# Altium schematic sheet Power.SchDoc
size A3; SheetNumber: 4; SheetTotal: 4
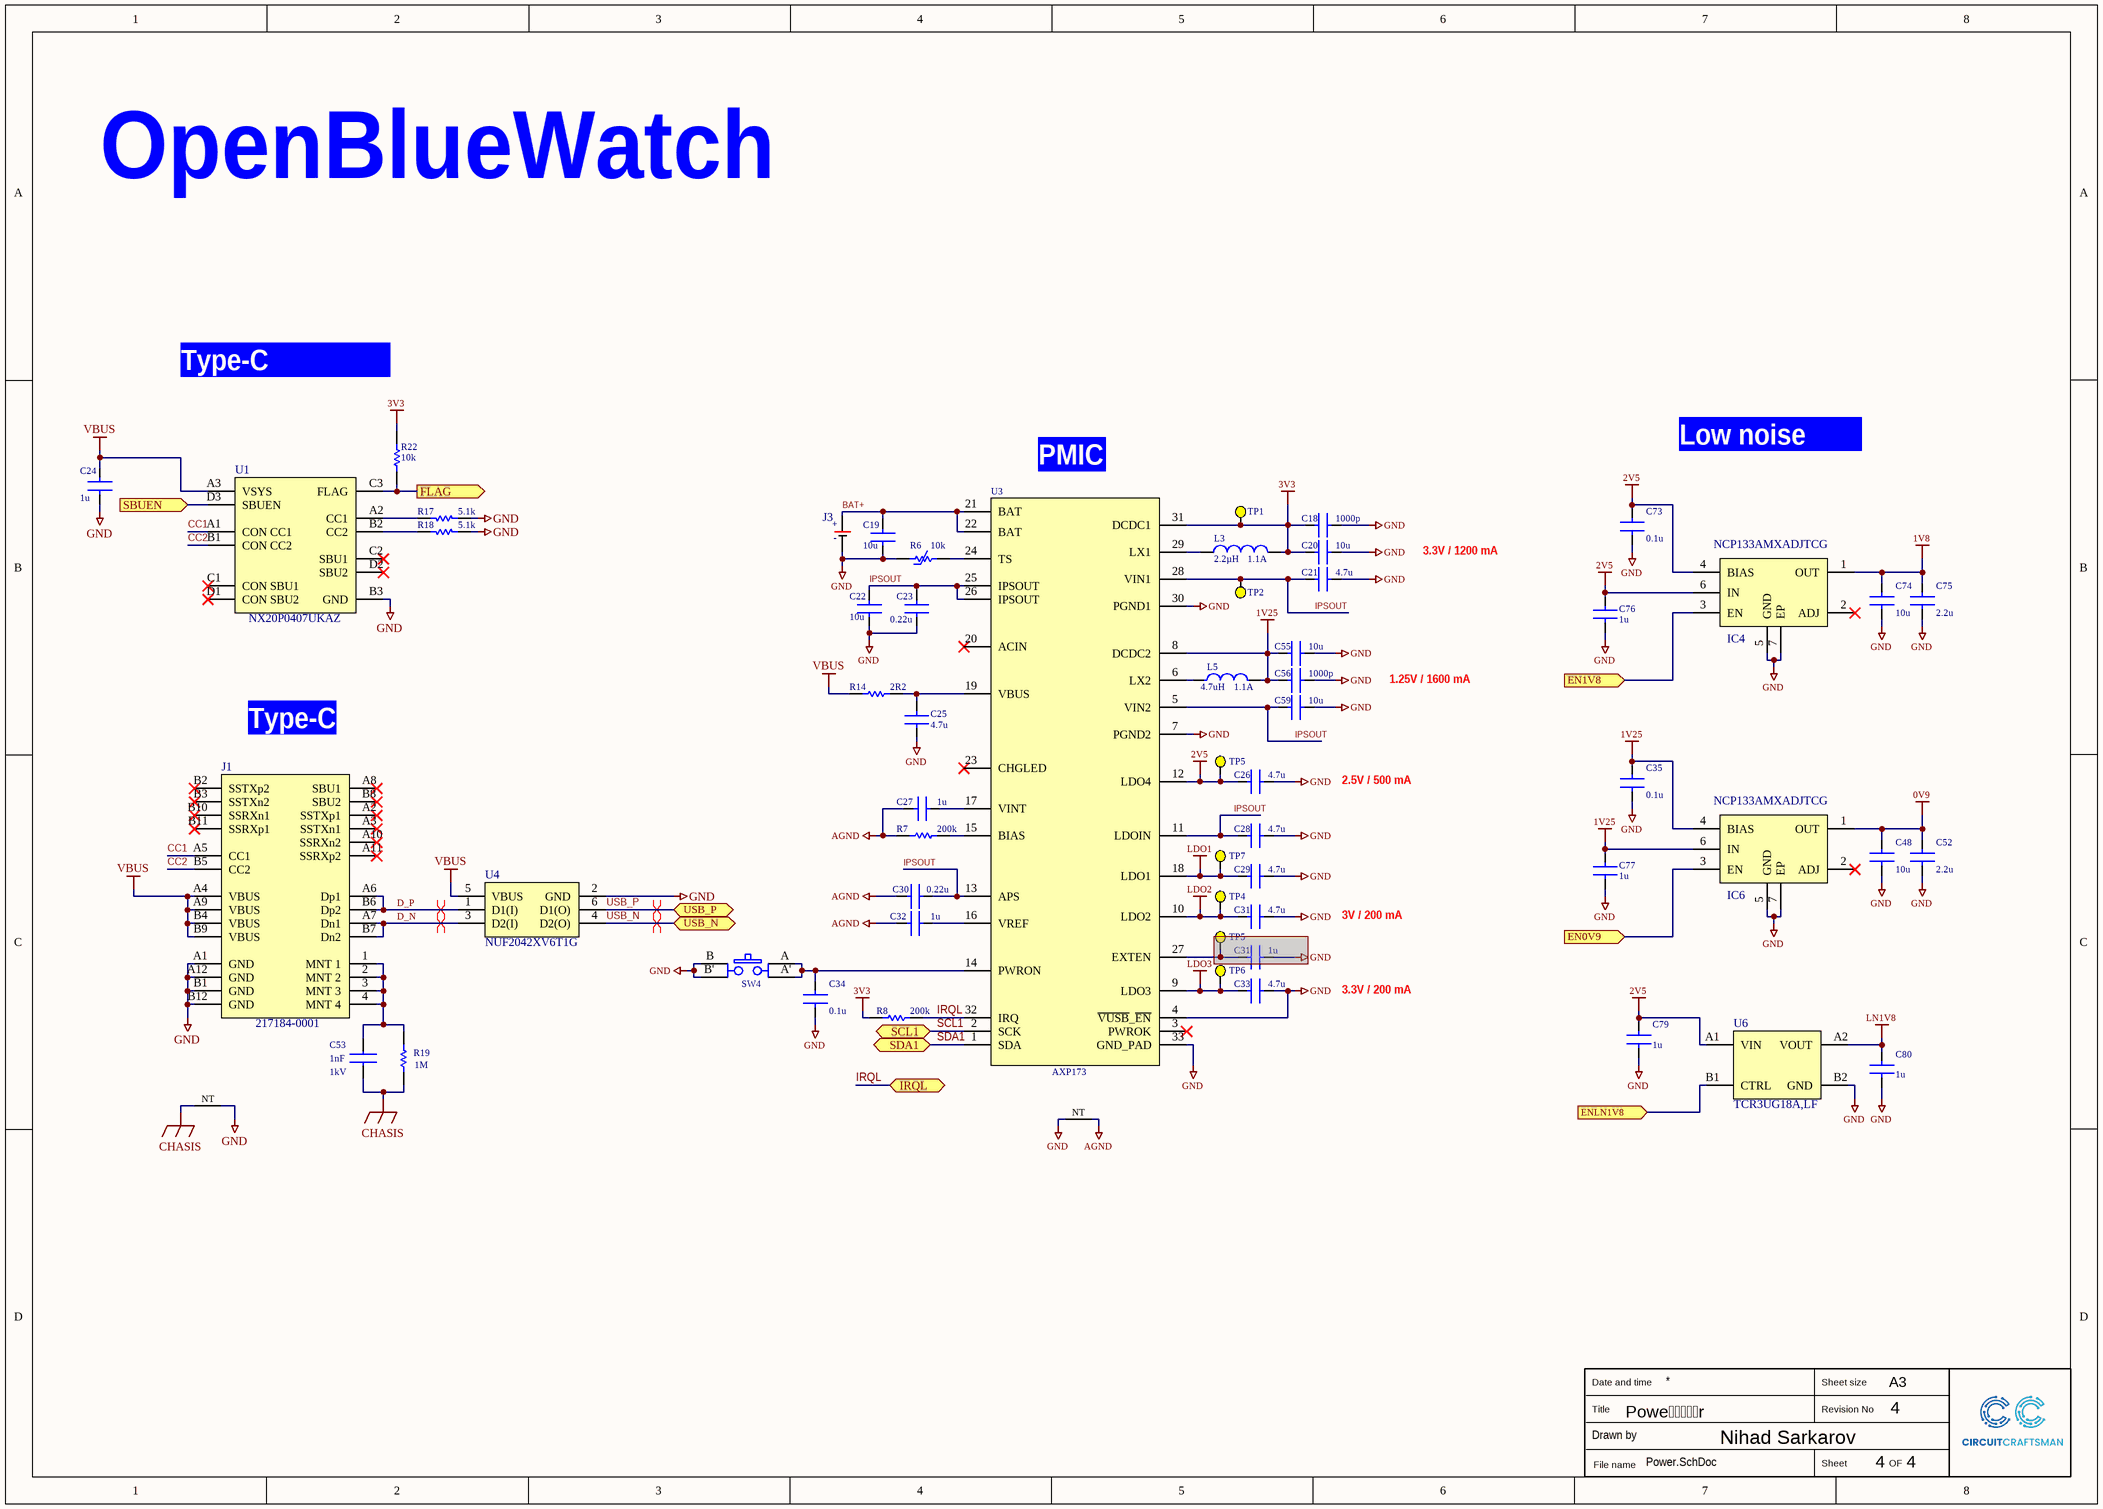
[diagram p0: Power.SchDoc]

## Parts
(Parts that share a designator on the sheet are numbered #1, #2 ... from top to bottom, then left to right.)
C18  Capacitance: 1000p  [FP-C1608-080-0_1-MFG]  (hidden comment: C1608X7R1E105K080AB)
C19  Capacitance: 10u  [FP-C1608-080-0_1-MFG]  (hidden comment: C1608X7R1E105K080AB)
C20  Capacitance: 10u  [FP-C1608-080-0_1-MFG]  (hidden comment: C1608X7R1E105K080AB)
C21  Capacitance: 4.7u  [FP-C1608-080-0_1-MFG]  (hidden comment: C1608X7R1E105K080AB)
C22  Capacitance: 10u  [FP-C1608-080-0_1-MFG]  (hidden comment: C1608X7R1E105K080AB)
C23  Capacitance: 0.22u  [FP-C1608-080-0_1-MFG]  (hidden comment: C1608X7R1E105K080AB)
C24  Capacitance: 1u  [FP-C1608-080-0_1-MFG]  (hidden comment: C1608X7R1E105K080AB)
C25  Capacitance: 4.7u  [FP-C1608-080-0_1-MFG]  (hidden comment: C1608X7R1E105K080AB)
C26  Capacitance: 4.7u  [FP-C1608-080-0_1-MFG]  (hidden comment: C1608X7R1E105K080AB)
C27  Capacitance: 1u  [FP-C1608-080-0_1-MFG]  (hidden comment: C1608X7R1E105K080AB)
C28  Capacitance: 4.7u  [FP-C1608-080-0_1-MFG]  (hidden comment: C1608X7R1E105K080AB)
C29  Capacitance: 4.7u  [FP-C1608-080-0_1-MFG]  (hidden comment: C1608X7R1E105K080AB)
C30  Capacitance: 0.22u  [FP-C1608-080-0_1-MFG]  (hidden comment: C1608X7R1E105K080AB)
C31#1  Capacitance: 4.7u  [FP-C1608-080-0_1-MFG]  (hidden comment: C1608X7R1E105K080AB)
C31#2  value 1u  [FP-CC0201-BA-MFG]  (hidden comment: CC0201KRX7R8BB102)  (masked out: inside a compile mask, not in the netlist)
C32  Capacitance: 1u  [FP-C1608-080-0_1-MFG]  (hidden comment: C1608X7R1E105K080AB)
C33  Capacitance: 4.7u  [FP-C1608-080-0_1-MFG]  (hidden comment: C1608X7R1E105K080AB)
C34  value 0.1u  [FP-CC0402-IPC_C]  (hidden comment: CC0402KRX7R7BB104)
C35  value 0.1u  [FP-CC0402-IPC_C]  (hidden comment: CC0402KRX7R7BB104)
C48  Capacitance: 10u  [FP-C1608-080-0_1-MFG]  (hidden comment: C1608X7R1E105K080AB)
C52  Capacitance: 2.2u  [FP-C1608-080-0_1-MFG]  (hidden comment: C1608X7R1E105K080AB)
C53  Capacitance: 1nF  Voltage - Rated: 1kV  [CAPC1608X90N]  (hidden comment: C0603V102KDRAC7867)
C55  Capacitance: 10u  [FP-C1608-080-0_1-MFG]  (hidden comment: C1608X7R1E105K080AB)
C56  Capacitance: 1000p  [FP-C1608-080-0_1-MFG]  (hidden comment: C1608X7R1E105K080AB)
C59  Capacitance: 10u  [FP-C1608-080-0_1-MFG]  (hidden comment: C1608X7R1E105K080AB)
C73  value 0.1u  [FP-CC0402-IPC_C]  (hidden comment: CC0402KRX7R7BB104)
C74  Capacitance: 10u  [FP-C1608-080-0_1-MFG]  (hidden comment: C1608X7R1E105K080AB)
C75  Capacitance: 2.2u  [FP-C1608-080-0_1-MFG]  (hidden comment: C1608X7R1E105K080AB)
C76  Capacitance: 1u  [FP-C1608-080-0_1-MFG]  (hidden comment: C1608X7R1E105K080AB)
C77  Capacitance: 1u  [FP-C1608-080-0_1-MFG]  (hidden comment: C1608X7R1E105K080AB)
C79  value 1u  [FP-CC0402-IPC_C]  (hidden comment: CC0402KRX7R7BB104)
C80  value 1u  [FP-CC0402-IPC_C]  (hidden comment: CC0402KRX7R7BB104)
IC4  NCP133AMXADJTCG  [NCP133AMX110TCG]
IC6  NCP133AMXADJTCG  [NCP133AMX110TCG]
J1  217184-0001  [FP-217184-0001-MFG]
J3  Battery connector  [JST-PH 2.0MM]  (value not drawn)
L3  Inductance: 2.2µH  Current - Saturation: 1.1A  [INDC2013X140X50LL20T20]  (hidden comment: BRC2012T2R2MD)
L5  Max DC Current: 1.1A  Inductance: 4.7uH  [FP-LQM2MPN_G0-MFG]  (hidden comment: LQM2MPN4R7MG0L)
Nt1  Net tie  [Net tie]  (value not drawn)  (net tie, no BOM)
Nt2  Net tie  [Net tie]  (value not drawn)  (net tie, no BOM)
R6  Resistance: 10k  [FP-NTSD1_FPB30-MFG]  (hidden comment: NTSD1XH103FPB30)
R7  Resistance: 200k  [RESC1005X40X25LL05T05]  (hidden comment: CRCW040222R0FKED)
R8  Resistance: 200k  [RESC0603X28X15LL5T05]  (hidden comment: CRCW02010000Z0ED)
R14  Resistance: 2R2  [RESC1005X40X25LL05T05]  (hidden comment: CRCW040222R0FKED)
R17  Resistance: 5.1k  [RESC0603X28X15LL5T05]  (hidden comment: CRCW02010000Z0ED)
R18  Resistance: 5.1k  [RESC0603X28X15LL5T05]  (hidden comment: CRCW02010000Z0ED)
R19  Resistance: 1M  [RESC1005X40X25ML05T05]  (hidden comment: ERJ-2GEJ105X)
R22  Resistance: 10k  [RESC0603X28X15LL5T05]  (hidden comment: CRCW02010000Z0ED)
SW4  EVP-BB2A9B000  [FP-EVP-BB2A9B000-MFG]  (value not drawn)
TP1  Test point  [Test point]  (value not drawn)
TP2  Test point  [Test point]  (value not drawn)
TP4  Test point  [Test point]  (value not drawn)
TP5#1  Test point  [Test point]  (value not drawn)
TP5#2  Test point  [Test point]  (value not drawn)  (masked out: inside a compile mask, not in the netlist)
TP6  Test point  [Test point]  (value not drawn)
TP7  Test point  [Test point]  (value not drawn)
U1  NX20P0407UKAZ  [FP-SOT1390-7-IPC_A]
U3  AXP173  [QFN40P400X400X55-33N]
U4  NUF2042XV6T1G  [FP-463A-MFG]
U6  TCR3UG18A,LF  [FP-WCSP4F-IPC_C]

## Ports
EN0V9 (in, see MCU[2C]), EN1V8 (in, see MCU[4A]), ENLN1V8 (in, see MCU[4B]), FLAG (out, see MCU[2B]), IRQL (bidir, see MCU[5D]), SBUEN (in, see MCU[2B]), SCL1 (bidir, see MCU[4D]), SDA1 (bidir, see MCU[4D]), USB_N (bidir, see MCU[6A]), USB_P (bidir, see MCU[6A])

## Nets
0V9: C48.1 C52.1 IC6.1(OUT)
1V8: C74.1 C75.1 IC4.1(OUT)
1V25: C35.1 C55.1 C56.1 C77.1 IC6.4(BIAS) IC6.6(IN) L5.2 U3.8(DCDC2)
2V5: C26.1 C73.1 C76.1 C79.1 IC4.4(BIAS) IC4.6(IN) TP5#1.1 U3.12(LDO4) U6.A1(VIN)
3V3: C18.1 C20.1 L3.2 R8.2 R22.1 TP1.1 U3.31(DCDC1)
AGND: C27.2 C30.2 C32.2 Nt1.2 R7.1
CHASIS: C53.1 Nt2.1 R19.1
GND: C18.2 C19.1 C20.2 C21.2 C22.1 C23.1 C24.2 C25.1 C26.2 C28.2 C29.2 C31#1.2 C33.2 C34.2 C35.2 C48.2 C52.2 C55.2 C56.2 C59.2 C73.2 C74.2 C75.2 C76.2 C77.2 C79.2 C80.2 IC4.5(GND) IC4.7(EP) IC6.5(GND) IC6.7(EP) J1.A1(GND) J1.A12(GND) J1.B1(GND) J1.B12(GND) J3.2(GND) Nt1.1 Nt2.2 R6.1 R17.1 R18.1 SW4.B SW4.B' U1.B3(GND) U3.4(~{VUSB}_~{EN}) U3.7(PGND2) U3.30(PGND1) U3.33(GND_PAD) U4.2(GND) U6.B2(GND)
LDO1: C29.1 TP7.1 U3.18(LDO1)
LDO2: C31#1.1 TP4.1 U3.10(LDO2)
LDO3: C33.1 TP6.1 U3.9(LDO3)
LN1V8: C80.1 U6.A2(VOUT)
VBUS: C24.1 J1.A4(VBUS) J1.A9(VBUS) J1.B4(VBUS) J1.B9(VBUS) R14.1 U1.A3(VSYS) U4.5(VBUS)
BAT+: C19.2 J3.1(+) U3.21(BAT) U3.22(BAT)
CC1: J1.A5(CC1) U1.A1(CON_CC1)
CC2: J1.B5(CC2) U1.B1(CON_CC2)
D_N: J1.A7(Dn1) J1.B7(Dn2) U4.3(D2(I))
D_P: J1.A6(Dp1) J1.B6(Dp2) U4.1(D1(I))
EN0V9: IC6.3(EN) ; port EN0V9
EN1V8: IC4.3(EN) ; port EN1V8
ENLN1V8: U6.B1(CTRL) ; port ENLN1V8
FLAG: R22.2 U1.C3(FLAG) ; port FLAG
IPSOUT: C21.1 C22.2 C23.2 C28.1 C30.1 C59.1 TP2.1 U3.5(VIN2) U3.11(LDOIN) U3.13(APS) U3.25(IPSOUT) U3.26(IPSOUT) U3.28(VIN1)
IRQL: R8.1 U3.32(IRQ) ; port IRQL
SBUEN: U1.D3(SBUEN) ; port SBUEN
SCL1: U3.2(SCK) ; port SCL1
SDA1: U3.1(SDA) ; port SDA1
USB_N: U4.4(D2(O)) ; port USB_N
USB_P: U4.6(D1(O)) ; port USB_P
NetC25_2: C25.2 R14.2 U3.19(VBUS)
NetC27_1: C27.1 U3.17(VINT)
NetC32_1: C32.1 U3.16(VREF)
NetC34_1: C34.1 SW4.A SW4.A' U3.14(PWRON)
NetC53_2: C53.2 J1.1(MNT_1) J1.2(MNT_2) J1.3(MNT_3) J1.4(MNT_4) R19.2
NetL3_1: L3.1 U3.29(LX1)
NetL5_1: L5.1 U3.6(LX2)
NetR6_2: R6.2 U3.24(TS)
NetR7_2: R7.2 U3.15(BIAS)
NetR17_2: R17.2 U1.A2(CC1)
NetR18_2: R18.2 U1.B2(CC2)

Not connected (* = marked no-connect by the designer): IC4 2(ADJ)*; IC6 2(ADJ)*; J1 A2(SSTXp1)* A3(SSTXn1)* A8(SBU1)* A10(SSRXn2)* A11(SSRXp2)* B2(SSTXp2)* B3(SSTXn2)* B8(SBU2)* B10(SSRXn1)* B11(SSRXp1)*; U1 C1(CON_SBU1)* C2(SBU1)* D1(CON_SBU2)* D2(SBU2)*; U3 3(PWROK)* 20(ACIN)* 23(CHGLED)* 27(EXTEN)

## Layout directives
differential pair; differential pair class 90USB: D_N, D_P, USB_N, USB_P

## Notes on the sheet
- OpenBlueWatch
- Type-C protection
- Low noise LDOs
- (near U3) PMIC
- 3.3V / 1200 mA
- 1.25V / 1600 mA
- Type-C
- 2.5V / 500 mA
- 3V / 200 mA
- 3.3V / 200 mA
- Power
- 4
- Date and time
- Sheet size
- A3
- Title
- Drawn by
- File name
- Nihad Sarkarov
- Sheet
- Revision No
- OF
- (in symbol Battery connector) -
- (in symbol Net Tie) NT

## Library data of the parts
C18-C30 C31#1 C32 C33 C48 C52 C55 C56 C59 C74-C77 = CMP-08246-005723-1: Multilayer Ceramic Capacitors 1μF ±10% 25V X7R SMD 0603; Mount: Surface Mount; Series: C; Tolerance: 10%; RoHS Compliant: Yes; Packaging: Tape and Reel; Case Code (Imperial): 0603; Height: 0.8mm; Case/Package: 0603; REACH SVHC: No SVHC; Thickness: 0.037inch; Voltage: 25V; Voltage Rating (DC): 25V; Construction: Flat; Case Code (Metric): 1608; Radiation Hardening: No; Package Quantity: 4000; Weight: 7.1E-05oz; Width: 0.031inch; Resistor Type: Ceramic; Termination: SMD/SMT; Depth: 0.8mm; Lead Free: Lead Free; Min Operating Temperature: -55°C; Length: 1.6mm; Dielectric: X7R; Max Operating Temperature: 125°C; Voltage Rating: 25V; Dielectric Material: Ceramic
C31#2 = CMP-03422-000456-1: CAP CER X7R 0201; Manufacturer: Yageo; Temperature Coefficient: 15%; Tolerance: 0.1; Voltage Rating: 25 V; Material: Ceramic; Footprint Url: http://www.yageo.com/exep/pages/download/literatures/UPY-C_GEN_24.pdf; Digikey Description: CAP CER 1000PF 25V X7R 0201; ComponentLink2URL: http://www.yageo.com/documents/recent/UPY-GPHC_X5R_4V-to-50V_25.pdf; Manufacturer Part Number: CC0201KRX7R8BB102; Lead Free: Yes; Temperature: -55°C to +85°C; Package: CC0201-BA; Automotive: No; Device Class L1: Passive Components; ComponentLink2Description: Datasheet; Octopart: https://octopart.com/cc0201krx7r8bb102-yageo-9292631; Temperature Range High: +85°C; Device Class L3: Ceramic Capacitors; Temperature Range Low: -55°C; Category: Cap; Device Class L2: Capacitors; Ipc Land Pattern Name: CAPC6030X30; Height: 0.33mm; Temperature Characteristic: X7R; RoHS: TRUE; Mouser Description: Multilayer Ceramic Capacitors MLCC - SMD/SMT 1.0nF 25V X7R 10%; Capacitance: 1u
C34 C35 C73 C79 C80 = CMP-03422-000048-1: CAP CER  X7R 0402; Manufacturer: YAGEO; Material: Ceramic; Automotive Grade: NA; Temperature Coefficient: 30ppm/°C; Voltage Rating: 16 V; Tolerance: 0.1; Device Class L1: Passive Components; Temperature Range Low: -55°C; Device Class L3: Ceramic Capacitors; Temperature Characteristic: X7R; Ipc Land Pattern Name: CAPC10050X50; Temperature Range High: +125°C; Temperature: -55°C to +125°C; RoHS: TRUE; Automotive: No; Height: 0.55mm; Device Class L2: Capacitors; Digikey Description: CAP CER 0.1UF 16V X7R 0402; Package: CC0402; Footprint Url: http://www.yageo.com/exep/pages/download/literatures/UPY-C_GEN_24.pdf; ComponentLink2Description: Datasheet; Category: Cap; Lead Free: Yes; Octopart: https://octopart.com/cc0402krx7r7bb104-yageo-42244624; ComponentLink2URL: http://www.yageo.com/documents/recent/UPY-GP_NP0_16V-to-50V_16.pdf; Manufacturer Part Number: CC0402KRX7R7BB104; Mouser Description: 0402 0.1 uF 16 V ±10 % Tolerance X7R SMT Multilayer Ceramic Capacitor
  C34 C35 C73: Capacitance: 0.1u
  C79 C80: Capacitance: 1u
C53 = C0603V102KDRAC7867: 1000 pF ±10% 1000V (1kV) Ceramic Capacitor X7R 0603 (1608 Metric); Manufacturer_Name: KEMET; Datasheet Link: https://api.kemet.com/component-edge/download/specsheet/C0603V102KDRAC7867.pdf; Height: 0.9mm; Manufacturer_Part_Number: C0603V102KDRAC7867; Mouser Part Number: N/A; Mouser Price/Stock: https://www.mouser.co.uk/ProductDetail/KEMET/C0603V102KDRAC7867?qs=sSYV1F9c5cFUkpdTww7WIA%3D%3D; Arrow Part Number: C0603V102KDRAC7867; Arrow Price/Stock: https://www.arrow.com/en/products/c0603v102kdrac7867/kemet-corporation; Supplier 1: Digikey; Supplier Part Number 1: 399-12306-1-ND
IC4 IC6 = NCP133AMXADJTCG: Integrated Circuit; Manufacturer_Name: onsemi; Datasheet Link: http://www.onsemi.com/pub/Collateral/NCP133-D.PDF; Height: 0mm; Manufacturer_Part_Number: NCP133AMXADJTCG; Mouser Part Number: 863-NCP133AMXADJTCG; Mouser Price/Stock: https://www.mouser.co.uk/ProductDetail/onsemi/NCP133AMXADJTCG?qs=7lMtFQ21GD%2Fb0CQ5YAVOhw%3D%3D; Arrow Part Number: NCP133AMXADJTCG; Arrow Price/Stock: https://www.arrow.com/en/products/ncp133amxadjtcg/on-semiconductor?region=nac
  IC4: Supplier 1: Avnet; Supplier Part Number 1: NCP133AMXADJTCG
J1 = CMP-04767-000027-1: MID-MOUNT DUAL ROWS SMT 24POS -T
J3 = Battery connector: JST-PH 2.0MM
L3 = CMP-2000-05964-1: Wire-Wound Chip Power Inductor, 2.2 uH, +/- 20%, -40 to 105 degC, 2-Pin SMD (0805), RoHS, Tape and Reel; Manufacturer: Taiyo Yuden; Other Names: 587-2905-2 / LQBRC2012T2R2MD; Type: Wirewound; Online Catalog: BRSeries; EDA / CAD Models: DownloadfromAcceleratedDesigns; Shielding: Unshielded; DC Resistance (DCR): 143mOhmMax; Current Rating: 1A; Frequency - Test: 1MHz; Frequency - Self Resonant: 350MHz; Series: BR; Size / Dimension: 0.079"Lx0.049"W(2.00mmx1.25mm); Datasheet URL: http://ds.yuden.co.jp/TYCOMPAS/ut/detail.do?productNo=BRC2012T2R2MD&fileName=BRC2012T2R2MD_SS&mode=specSheetDownload; Tolerance: ±20%; Mounting Technology: SurfaceMount; Standard Package: 2,000; Category: Inductors,Coils,Chokes; Operating Temperature: -40°C~105°C; Mounting Type: SurfaceMount; Height - Seated (Max): 0.055"(1.40mm); Datasheet Version: 09/2016; Package Reference: 0805; Package Description: 2-Pin Surface Mount Device, Body 2 x 1.25 mm; Packaging: Tape&Reel(TR); Package / Case: 0805(2012Metric); Family: FixedInductors; Manufacturer URL: http://www.t-yuden.com/
L5 = CMP-06042-016483-1: Multilayer Type Inductor for Power Lines, 0806 (2016), 4.7μH, 20%, 0.175Ω, 1.1A; Self Resonant Frequency: 20MHz; DC Resistance (DCR): 175mR; Test Frequency: 1MHz; Core Material: Ferrite; Shielding: Shielded; Case Code (Metric): 2016; Min Operating Temperature: -55°C; Military Standard: Not; Depth: 1.75mm; RoHS Compliant: Yes; Packaging: Tape and Reel; Termination: SMD/SMT; Max Operating Temperature: 125°C; Case Code (Imperial): 0806; Width: 0.049inch; Package Quantity: 3000; Length: 0.079inch; DC Current: 1.1A; Mount: Surface Mount; Current Rating: 1.1A; Height - Seated (Max): 0.039inch; Case/Package: 0805; Weight: 0.000353oz; Height: 0.9mm; Tolerance: 20%
R6 = CMP-06022-000009-1: NTC Thermistors 10kΩ  	±1%  Current  	0.12mA Radial; Max Power Dissipation: 15mW; Length: 3mm; Packaging: Bulk; Min Operating Temperature: -40°C; Max Operating Temperature: 125°C; Depth: 2mm; Lead Free: Lead Free; Mount: Through Hole; Radiation Hardening: No; Number of Pins: 2; Tolerance: 1%; ComponentLink1Description: Link; ComponentLink1URL: https://www.digikey.com/en/products/detail/tinycircuits/ASR00003/7404516
R7 R14 = CMP-2002-08382-1: Manufacturer: Vishay Dale; Part Number: CRCW040222R0FKED
R8 R17 R18 R22 = CMP-2004-00001-2: Chip Resistor, 0 Ohm, 0.05 W, -55 to 155 degC, 0201 (0603 Metric), RoHS, Tape and Reel; Voltage Rating: 30 V; Case\Package: 0201; Tolerance: 5%; Power Rating: 50 mW; REACH SVHC: Unknown; Length: 0.6 mm; Packaging: Cut Tape; Weight: 6E-06 oz; ComponentLink2URL: http://www.vishay.com/docs/20052/crcw0201e3.pdf; Mounting Technology: Surface Mount; Case Code (Imperial): 0201; Radiation Hardening: No; RoHSCompliant: true; Package Quantity: 1; Min Operating Temperature: -55 degC; Height: 0.23 mm; PackageReference: 0201; ComponentLink1Description: Manufacturer URL; ComponentLink2Description: Datasheet; Case Code (Metric): 0603; DatasheetVersion: 03/2016; Width: 0.3 mm; Mount: Surface Mount; PackageDescription: 2-Pin Surface Mount Device, Body 0.6 x 0.3 mm; ComponentLink1URL: http://www.vishay.com/; Max Operating Temperature: 155 degC
R19 = CMP-1011-00146-2: Manufacturer: Panasonic; Part Number: ERJ-2GEJ105X
SW4 = CMP-05618-000013-1: SWITCH TACTILE SPST-NO 0.02A 15V; Manufacturer: Panasonic; Electromechanical Life: 500000Cycles; Contact Resistance: 500mΩ; Operating Force: 1.6N; Standoff Height: 0.025mm; Contact Current Rating: 20mA; Automotive: No; Digikey Description: SWITCH TACTILE SPST-NO 0.02A 15V; Octopart: https://octopart.com/evp-bb2a9b000-panasonic-75477754; Lead Free: Yes; Device Class L2: Switches; Temperature Range Low: -40°C; Temperature: -40°C to +85°C; Mount: Surface Mount; Temperature Range High: +85°C; Throw Configuration: SPST-NO; Device Class L1: Electromechanical; Height: 0.63mm; Manufacturer Part Number: EVP-BB2A9B000; Package: 0; ComponentLink2Description: Datasheet; Category: Switch; RoHS: TRUE; ComponentLink2URL: https://www3.panasonic.biz/ac/e_download/control/switch/light-touch/catalog/sw_lt_eng_2616s.pdf?f_cd=402266&via=ok; Voltage Rating Dc: 15V; Device Class L3: Tactile Switches
TP1 TP2 TP4 TP5#1 TP5#2 TP6 TP7 = Test point: 1mm x 1mm round pad for testing purposes
U1 = CMP-10136-000007-1: USB TYPE-C CC1/2 SBU1/2 PROT IC; Supplier 1: Digikey; Supplier Part Number 1: 568-13844-1-ND
U3 = AXP173: AXP173 is a highly integrated power system management chip, targeting single-cell lithium batteries (lithium ion or lithium polymer) and requiring multi-channel power conversion / Output applications provide a complete power solution that is easy to use and can be flexibly configured to fully meet the increasingly complex application processing.; ComponentLink1Description: Datasheet; ComponentLink1URL: https://www.datasheet-pdf.com/PDF/AXP173-Datasheet-X-Powers-966875; ComponentLink2Description: Supplier; ComponentLink2URL: https://aliexpress.ru/item/32915474138.html?sku_id=10000001886631882&spm=a2g2w.productlist.search_results.0.7dc021d8WYAc3c
U4 = CMP-1066-00027-2: RC (Pi) EMI Filter 2nd Order Low Pass 2 Channel R = 22Ohms, C = 42pF (Total) SOT-563, SOT-666; Max DC Current: 100nA; Max Breakdown Voltage: 8V; Direction: Bidirectional; Number of Channels: 3; DC Resistance (DCR): 26.4R; ESD Protection: Yes; Length: 0.063inch; Package Quantity: 4000; Case/Package: SOT-563-6; Termination: Gull Wing; Radiation Hardening: No; Lead Free: Lead Free; Halogen Free: Halogen Free; Width: 0.047inch; Min Operating Temperature: -55°C; Packaging: Tape and Reel; Capacitance: 42pF; Height: 0.024inch; Number of Pins: 6; Max Operating Temperature: 125°C; Contact Plating: Tin; Number of Lines: 3; Depth: 1.7mm; Supplier 1: Future Electronics; Supplier Part Number 1: 4631438
U6 = CMP-35871-000003-1: IC REG LINEAR 1.8V 300MA 4WCSP-F; Manufacturer: Toshiba; Max Supply Voltage: 5.5V; Dropout Voltage: 335mV; Min Supply Voltage: 1.5V; Number Of Outputs: 1; Standoff Height: 0.08mm; Output Type: Fixed; Max Power Dissipation: 800mW; Accuracy Percentage: 1%; Max Junction Temp: +150°C; Nominal Supply Current: 0.34-0.38uA; Device Class L2: Power Management ICs; ComponentLink2URL: https://toshiba.semicon-storage.com/info/docget.jsp?did=59176&prodName=TCR3UG18A; Octopart: https://octopart.com/tcr3ug18a%2Clf-toshiba-87552120; Category: IC; Device Class L1: Integrated Circuits (ICs); Ipc Land Pattern Name: BGA4N35P2X2_64X64X33; Device Class L3: Voltage Regulators - Linear; Temperature Range High: +85°C; ComponentLink2Description: Datasheet; Height: 0.33mm; Package: WCSP4F; RoHS: TRUE; Temperature Range Low: -40°C; Lead Free: Yes; Output Voltage: 1.8V; Temperature: -40°C to +85°C; Automotive: No; Manufacturer Part Number: TCR3UG18A,LF; Digikey Description: IC REG LINEAR 1.8V 300MA 4WCSP-F; Output Current: 300mA; Supplier 1: Avnet; Supplier Part Number 1: TCR3UG18A,LF